# EasyEDA Pro project ProPrj_农9.7_2025-10-01.epro, board PCB3_3
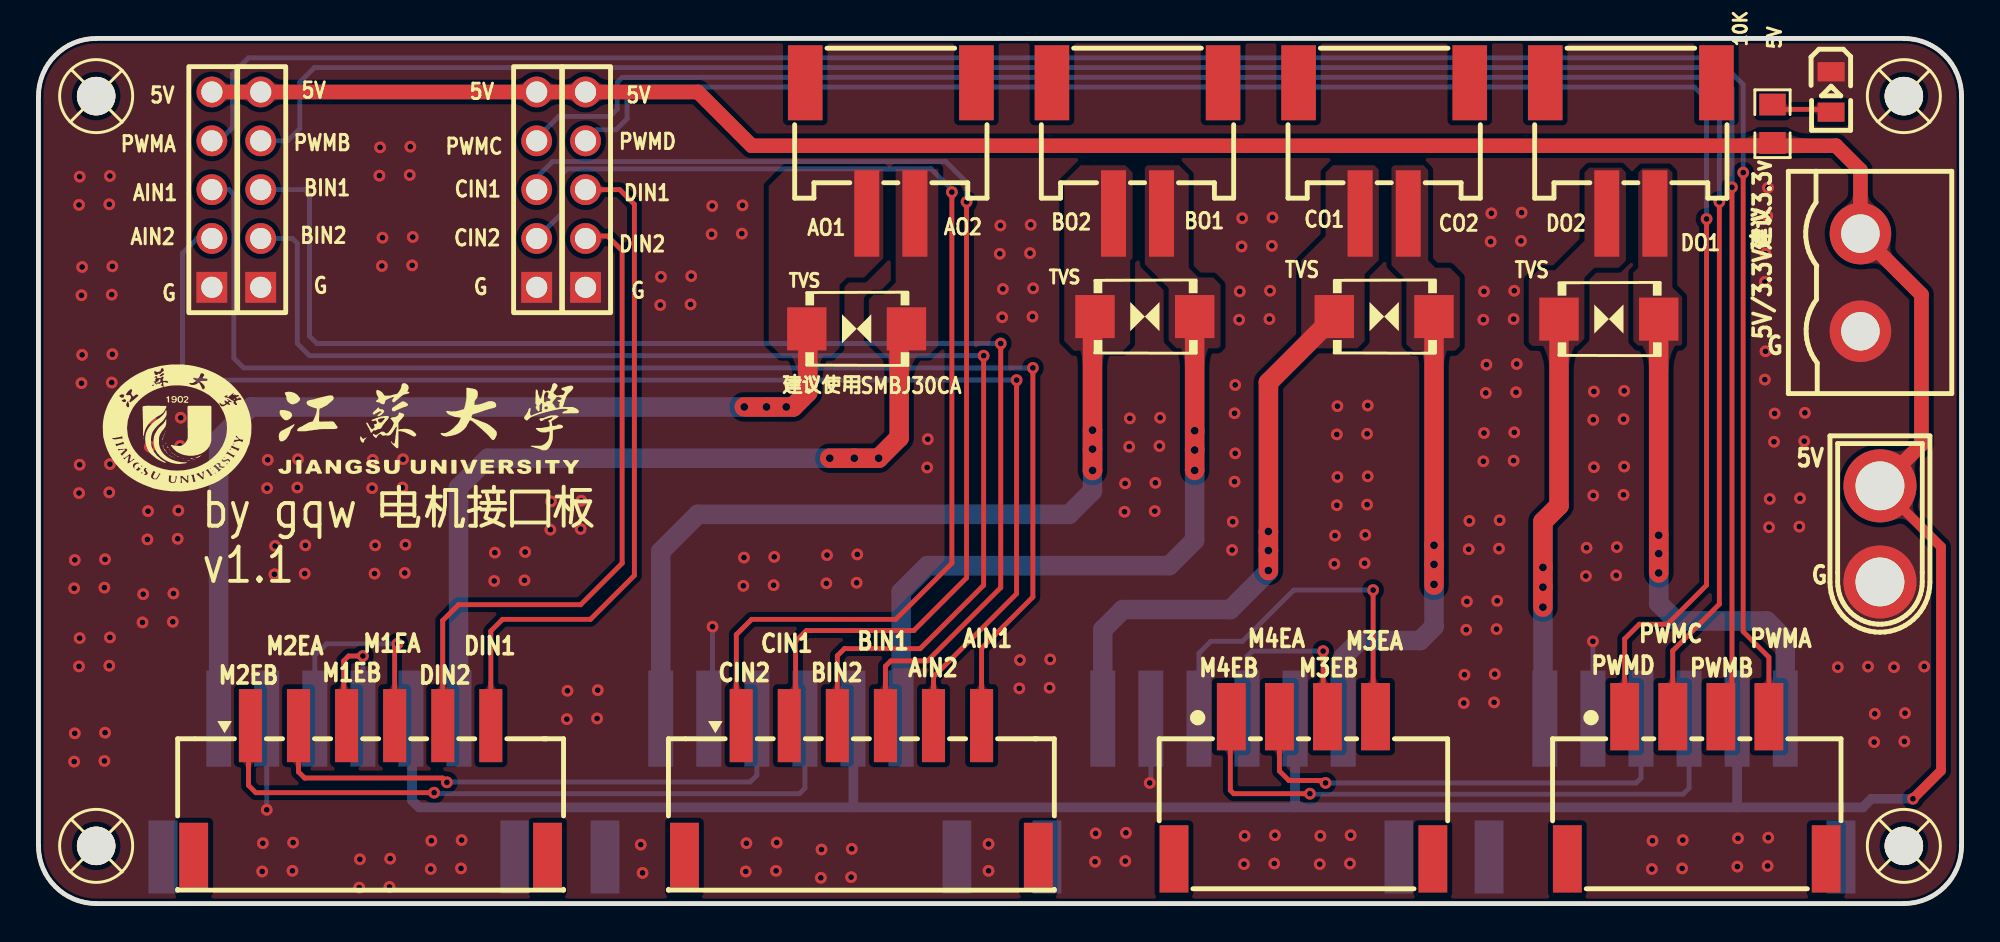
[diagram p8: board, top side]
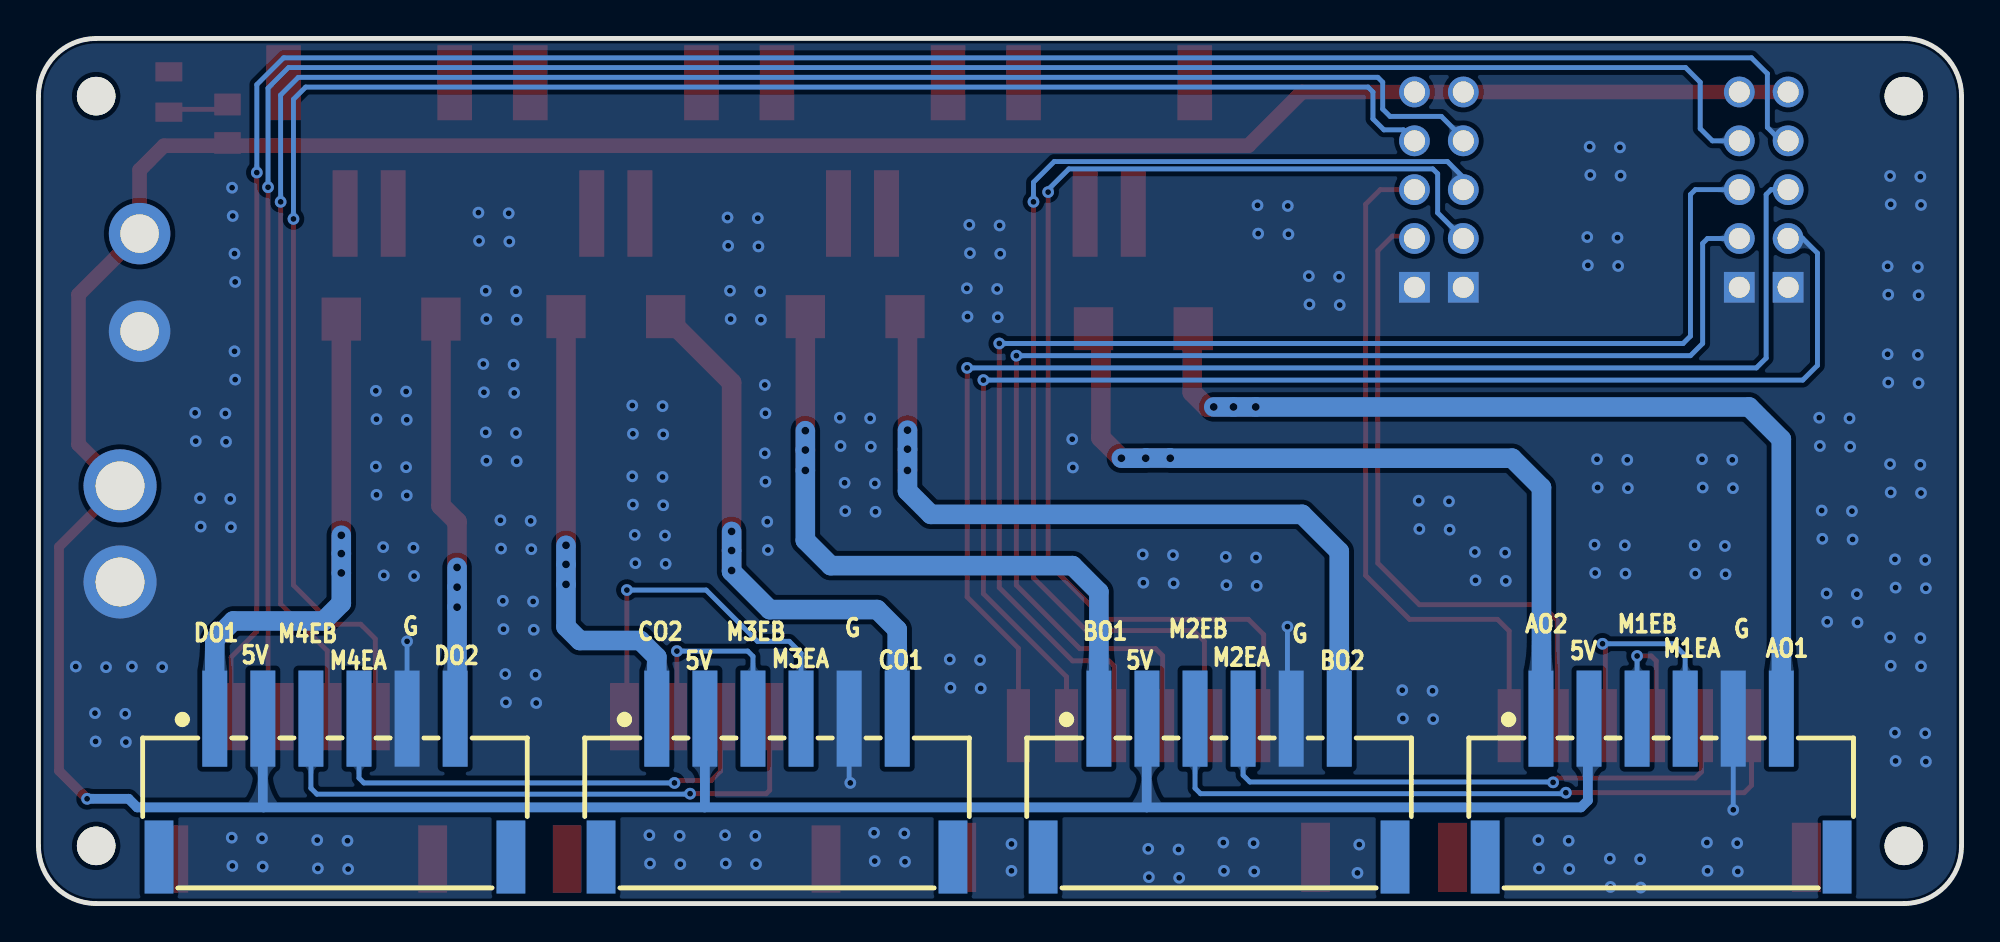
[diagram p9: board, bottom side, seen from below]

Outline 100 x 45 mm; copper layers: Top Layer, Bottom Layer. Coordinates in mm from the lower left corner of the outline.
Outline path: 0,42 0,3 arc(0.88,0.88) 3,0 97,0 arc(99.12,0.88) 100,3 100,42 arc(99.12,44.12) 97,45 3,45 arc(0.88,44.12) 0,42
Stack: Top Layer 0.035mm / Dielectric1 1.51mm FR4 er 4.5 / Bottom Layer 0.035mm

## Design rules (mm)
template: 自定义配置
spacing copperThickness1oz (default): track to track 0.102, other pairs 0.152 to 0.3
spacing copperThickness2oz: track to track 0.203, other pairs 0.152 to 0.3
track width copperThickness1oz (default): min 0.127, default 0.254, max 2.54
track width copperThickness2oz: min 0.203, default 0.254, max 2.54
differential pair differentialPair (default): width min 0.127, default 0.254, max 2.54; gap min 0.152, default 0.152
via viaSize (default): diameter min 0.5, default 0.61, max 10; hole min 0.3, default 0.305, max 6.299

## Placement (name value [footprint] x y rotation side)
5V  NCD0805R1  [LED0805-R-RD]  93.22 42.22 270 top
10K  10K  [R0805]  90.17 40.56 90 top
CN13  HCZZ0021-2  [CONN-SMD_2P-P2.50-A2501-WF-02A]  44.32 39.29 0 top
CN16  WAFER-XH2.54-4PWB  [CONN-TH_4P-P0.20_XUNPU_WAFER-XH2.54-4PWB]  86.23 6.02 0 top
CN49  DB2EVC-5.08-2P-GN  [CONN-TH_2P-P5.08_DB2EVC-5.08-2P]  94.74 32.31 90 top
CN57  XT30U-M  [CONN-TH_XT30U-M]  95.76 19.23 270 top
CN61  WAFER-XH2.54-4PWB  [CONN-TH_4P-P0.20_XUNPU_WAFER-XH2.54-4PWB]  65.78 6.02 0 top
CN62  HCZZ0021-2  [CONN-SMD_2P-P2.50-A2501-WF-02A]  57.15 39.29 0 top
CN63  HCZZ0021-2  [CONN-SMD_2P-P2.50-A2501-WF-02A]  69.98 39.29 0 top
CN64  HCZZ0021-2  [CONN-SMD_2P-P2.50-A2501-WF-02A]  82.8 39.29 0 top
D3  SMBJ30CA  [SMB_L4.6-W3.6-LS5.3-BI]  69.98 30.53 0 top
D4  SMBJ30CA  [SMB_L4.6-W3.6-LS5.3-BI]  81.66 30.4 0 top
SCREW1  -  [M2螺丝]  97 3 0 top
SCREW2  -  [M2螺丝]  3 3 0 top
SCREW3  -  [M2螺丝]  97 42 0 top
SCREW4  -  [M2螺丝]  3 42 0 top
TVS  -  [SMB_L4.6-W3.6-LS5.3-BI]  42.54 29.9 0 top
TVS#2  -  [SMB_L4.6-W3.6-LS5.3-BI]  57.53 30.53 0 top
U6  HX 2.54-6P WT  [CONN-SMD_6P-P2.50_HANXIA_HX-2.54-6P-WT]  84.58 6.02 180 bottom
U11  2.54-6PWT  [COMM-SMD_6P-P2.50_SHOUHAN_2.54-6PWT]  42.79 5.83 0 top
U28  HX 2.54-6P WT  [CONN-SMD_6P-P2.50_HANXIA_HX-2.54-6P-WT]  61.59 6.02 180 bottom
U32  HX 2.54-6P WT  [CONN-SMD_6P-P2.50_HANXIA_HX-2.54-6P-WT]  15.62 6.02 180 bottom
U33  HX 2.54-6P WT  [CONN-SMD_6P-P2.50_HANXIA_HX-2.54-6P-WT]  38.61 6.02 180 bottom
U34  2.54-6PWT  [COMM-SMD_6P-P2.50_SHOUHAN_2.54-6PWT]  17.27 5.83 0 top
U35  双塑单排排针5PIN2.54间距  [HDR-TH_5P-P2.54-V-M-A]  9.02 37.14 90 top
U36  双塑单排排针5PIN2.54间距  [HDR-TH_5P-P2.54-V-M-A]  11.56 37.14 90 top
U37  双塑单排排针5PIN2.54间距  [HDR-TH_5P-P2.54-V-M-A]  25.91 37.14 90 top
U38  双塑单排排针5PIN2.54间距  [HDR-TH_5P-P2.54-V-M-A]  28.45 37.14 90 top

## Footprints (pads in the part's own frame, mm; a bottom-side part is the same pattern mirrored in y, then rotated)
COMM-SMD_6P-P2.50_SHOUHAN_2.54-6PWT
  rect 1.2x3.8 smd: 1(-6.25,3.425) 2(-3.75,3.425) 3(-1.25,3.425) 4(1.25,3.425) 5(3.75,3.425) 6(6.25,3.425)
  rect 1.5x3.6 smd: 7(9.2,-3.425) 8(-9.2,-3.425)
CONN-SMD_2P-P2.50-A2501-WF-02A
  rect 1.3x4.5 smd: 1(-1.25,-3.4) 2(1.25,-3.4)
  rect 1.8x3.9 smd: 3(-4.45,3.4) 4(4.45,3.4)
CONN-SMD_6P-P2.50_HANXIA_HX-2.54-6P-WT
  rect 1.3x5 smd: 1(-6.25,3.6) 2(-3.75,3.6) 3(-1.25,3.6) 4(1.25,3.6) 5(3.75,3.6) 6(6.25,3.6)
  rect 1.5x3.8 smd: 7(-9.15,-3.6) 8(9.15,-3.6)
CONN-TH_2P-P5.08_DB2EVC-5.08-2P
  round 3.2 hole 2: 1(-2.54,0) 2(2.54,0)
CONN-TH_4P-P0.20_XUNPU_WAFER-XH2.54-4PWB
  rect 1.5x3.5 smd: 1(-3.75,3.7) 2(-1.25,3.7) 3(1.25,3.7) 4(3.75,3.7) 5(-6.73,-3.7) 6(6.73,-3.7)
CONN-TH_XT30U-M
  round 3.8 hole 2.54: 1(-2.5,0) 2(2.5,0)
HDR-TH_5P-P2.54-V-M-A
  rect 1.6x1.6 hole 1.1: 1(-5.08,0)
  round 1.6 hole 1.1: 2(-2.54,0) 3(0,0) 4(2.54,0) 5(5.08,0)
LED0805-R-RD
  rect 1x1.399 smd: 1(1.05,0) 2(-1.05,0)
M2螺丝
  round 2 hole 2: 1(0,0)
R0805
  rect 1.133x1.377 smd: 1(-1,0) 2(1,0)
SMB_L4.6-W3.6-LS5.3-BI
  rect 2.047x2.241 smd: 1(-2.591,0) 2(2.591,0)

## Nets
5V: 10K.1 CN49.2 CN57.1 U6.2 U28.2 U32.2 U33.2 U35.5 U36.5 U37.5 U38.5
GND: 5V.2 CN49.1 CN57.2 U6.5 U28.5 U32.5 U33.5 U35.1 U36.1 U37.1 U38.1
AIN1: U11.6 U35.3
AIN2: U11.5 U35.2
AO1: CN13.1 TVS.1 U32.6
AO2: CN13.2 TVS.2 U32.1
BIN1: U11.4 U36.3
BIN2: U11.3 U36.2
BO1: CN62.2 TVS#2.2 U33.1
BO2: CN62.1 TVS#2.1 U33.6
CIN1: U11.2 U37.3
CIN2: U11.1 U37.2
CO1: CN63.1 D3.1 U28.6
CO2: CN63.2 D3.2 U28.1
DIN1: U34.6 U38.3
DIN2: U34.5 U38.2
DO1: CN64.2 D4.2 U6.1
DO2: CN64.1 D4.1 U6.6
M1_ENCODER_A: U32.4 U34.4
M1_ENCODER_B: U32.3 U34.3
M2_ENCODER_A: U33.4 U34.2
M2_ENCODER_B: U33.3 U34.1
M3_ENCODER_A: CN61.4 U28.4
M3_ENCODER_B: CN61.3 U28.3
M4_ENCODER_A: CN61.2 U6.4
M4_ENCODER_B: CN61.1 U6.3
PWMA: CN16.4 U35.4
PWMB: CN16.3 U36.4
PWMC: CN16.2 U37.4
PWMD: CN16.1 U38.4
$1N14387: 5V.1 10K.2

Pads without a net: CN13 3 4; CN16 5 6; CN61 5 6; CN62 3 4; CN63 3 4; CN64 3 4; SCREW1 1; SCREW2 1; SCREW3 1; SCREW4 1; U6 7 8; U11 7 8; U28 7 8; U32 7 8; U33 7 8; U34 7 8

## Via types
v1: diameter 0.61, hole 0.305, Top Layer to Bottom Layer, 269 vias
v2: diameter 0.813, hole 0.406, Top Layer to Bottom Layer, 24 vias

## Routing (per net, layer and track width the routed paths; a pad name or vN(x,y) marks a point on that pad's centre or on a via; arc(x,y) is an arc through that point)
5V: length 220.8
  Top Layer w0.508: v1(97.47,5.45) 98.93,6.91 98.93,18.55 CN57.1
  Top Layer w0.762: CN57.1 97.92,23.89 97.92,31.67 CN49.2 94.74,38.15 93.47,39.42 37.08,39.42 34.29,42.22 U38.5 U37.5 U36.5 U35.5
  Bottom Layer w0.508: U6.2 88.33,5.03 88.3,5 ; 42.37,5 19.79,5 19.43,5.36 19.43,9.56 U32.2 ; 42.37,5 42.37,9.61 U33.2 ; 42.37,5 65.36,5 ; 88.3,5 94.87,5 95.31,5.45 v1(97.47,5.45) ; 88.3,5 65.36,5 ; 65.36,5 65.34,5.02 U28.2
GND: length 17
  Bottom Layer w0.254: U33.5 35.05,9.81 v1(35.05,14.4) ; U28.5 57.84,6.33 v1(57.78,6.27) ; U6.5 v1(80.83,13.64) ; U32.5 v1(11.87,4.88)
  vias: v1(1.89,17.87) v1(1.86,16.4) v1(1.89,8.86) v1(1.86,7.38) v1(2.14,37.81) v1(2.11,36.34) v1(2.14,22.83) v1(2.11,21.35) v1(2.14,13.81) v1(2.11,12.34) v1(2.24,31.64) v1(2.24,27.07) v1(2.27,33.11) v1(2.27,28.54) v1(3.43,16.43) v1(3.43,7.42) v1(3.46,17.91) v1(3.46,8.89) v1(3.72,37.84) v1(3.68,36.37) v1(3.72,22.86) v1(3.68,21.39) v1(3.72,13.84) v1(3.68,12.37) v1(3.84,33.15) v1(3.81,31.67) v1(3.84,28.57) v1(3.81,27.1) v1(5.44,16.09) v1(5.41,14.62) v1(5.7,20.41) v1(5.67,18.94) v1(5.83,25.24) v1(5.79,23.77) v1(7.02,16.13) v1(6.98,14.66) v1(7.24,18.97) v1(7.27,20.45) v1(7.4,25.27) v1(7.37,23.8) v1(11.63,1.67) v1(11.67,3.14) v1(11.92,23.08) v1(11.89,21.61) v1(12.3,18.6) v1(12.27,17.13) v1(13.24,3.17) v1(13.21,1.7) v1(13.5,23.11) v1(13.46,21.64) v1(13.84,17.16) v1(13.88,18.63) v1(16.71,2.3) v1(16.68,0.83) v1(17.35,21.61) v1(17.38,23.08) v1(17.51,18.63) v1(17.48,17.16) v1(17.73,37.86) v1(17.76,39.33) v1(17.89,34.64) v1(17.86,33.16) v1(18.29,2.34) v1(18.25,0.87) v1(18.92,21.64) v1(18.96,23.11) v1(19.05,17.2) v1(19.08,18.67) v1(19.34,39.37) v1(19.3,37.9) v1(19.43,33.2) v1(19.46,34.67) v1(20.43,3.27) v1(20.4,1.8) v1(22,3.3) v1(21.97,1.83) v1(23.73,18.25) v1(23.7,16.78) v1(25.31,18.29) v1(25.27,16.81) v1(26.62,19.45) v1(26.65,20.92) v1(27.51,11.07) v1(27.48,9.59) v1(28.23,20.95) v1(28.19,19.48) v1(29.05,9.63) v1(29.08,11.1) v1(31.32,3.07) v1(31.41,1.59) v1(32.34,31.13) v1(32.37,32.6) v1(33.94,32.64) v1(33.91,31.17) v1(35.04,36.29) v1(35,34.82) v1(36.61,36.32) v1(36.58,34.85) v1(36.69,18) v1(36.65,16.53) v1(36.81,3.14) v1(36.78,1.67) v1(38.23,16.56) v1(38.26,18.03) v1(38.39,3.17) v1(38.35,1.7) v1(40.72,2.81) v1(40.68,1.34) v1(41,18.13) v1(40.97,16.65) v1(42.29,2.84) v1(42.26,1.37) v1(42.54,16.69) v1(42.58,18.16) v1(46.24,24.16) v1(46.21,22.68) v1(49.4,3.1) v1(49.4,1.7) v1(50.02,35.27) v1(49.99,33.8) v1(50.15,31.97) v1(50.12,30.5) v1(51.04,12.67) v1(51,11.19) v1(51.6,35.31) v1(51.56,33.83) v1(51.72,32) v1(51.69,30.53) v1(52.61,12.7) v1(52.58,11.23) v1(54.94,2.18) v1(54.97,3.65) v1(56.51,21.85) v1(56.47,20.38) v1(56.55,3.68) v1(56.51,2.21) v1(56.72,23.77) v1(56.75,25.24) v1(58.05,20.41) v1(58.08,21.89) v1(58.33,25.27) v1(58.29,23.8) v1(62.1,19.86) v1(62.07,18.39) v1(62.23,26.97) v1(62.2,25.5) v1(62.23,23.42) v1(62.2,21.95) v1(62.43,30.37) v1(62.47,31.84) v1(62.59,35.65) v1(62.56,34.18) v1(62.72,3.52) v1(62.69,2.05) v1(64.04,31.88) v1(64.01,30.4) v1(64.13,34.21) v1(64.17,35.69) v1(64.3,3.56) v1(64.26,2.08) v1(66.62,2.05) v1(66.66,3.52) v1(67.42,19.14) v1(67.39,17.67) v1(67.55,25.87) v1(67.51,24.4) v1(67.55,22.19) v1(67.51,20.72) v1(68.23,3.56) v1(68.2,2.08) v1(68.99,19.18) v1(68.96,17.7) v1(69.12,25.91) v1(69.09,24.44) v1(69.12,22.22) v1(69.09,20.75) v1(74.12,10.43) v1(74.25,14.24) v1(74.15,11.9) v1(74.28,15.71) v1(74.41,19.9) v1(74.37,18.43) v1(75.13,30.37) v1(75.13,23) v1(75.17,31.84) v1(75.17,24.48) v1(75.29,28.03) v1(75.26,26.56) v1(75.55,35.91) v1(75.51,34.43) v1(75.73,11.94) v1(75.69,10.47) v1(75.82,14.28) v1(75.95,18.47) v1(75.85,15.75) v1(75.98,19.94) v1(76.74,31.88) v1(76.71,30.4) v1(76.74,24.51) v1(76.71,23.04) v1(76.84,26.59) v1(76.87,28.07) v1(77.12,35.94) v1(77.09,34.47) v1(80.5,18.51) v1(80.47,17.04) v1(80.85,25.16) v1(80.85,21.23) v1(80.88,26.64) v1(80.88,22.7) v1(82.04,17.07) v1(82.08,18.54) v1(82.42,25.2) v1(82.42,21.26) v1(82.46,26.67) v1(82.46,22.73) v1(83.93,3.27) v1(83.9,1.8) v1(85.5,3.3) v1(85.47,1.83) v1(88.34,1.92) v1(88.38,3.39) v1(89.81,33.81) v1(89.77,32.33) v1(89.81,28.73) v1(89.77,27.25) v1(89.93,37.24) v1(89.9,35.76) v1(89.95,3.43) v1(89.92,1.96) v1(90.03,21.05) v1(89.99,19.58) v1(90.25,24.02) v1(90.28,25.49) v1(91.6,21.08) v1(91.57,19.61) v1(91.82,24.05) v1(91.85,25.53) v1(93.57,12.3) v1(95.14,12.33) v1(95.49,9.87) v1(95.45,8.4) v1(96.49,12.3) v1(97.03,8.43) v1(97.06,9.91) v1(98.06,12.33)
AIN1: length 71.2
  Top Layer w0.254: U11.6 49.04,13.28 51.71,15.95 v1(51.71,27.86)
  Bottom Layer w0.254: U35.3 9.91,37.14 10.16,36.88 10.16,28.37 10.67,27.86 v1(51.71,27.86)
AIN2: length 71.1
  Top Layer w0.254: v1(50.86,27.23) 50.86,16.12 46.54,11.8 U11.5
  Bottom Layer w0.254: v1(50.86,27.23) 8.25,27.23 7.49,27.99 7.49,33.83 8.25,34.59 U35.2
AO1: length 51.7
  Top Layer w1.016: TVS.1 40,29.84 40,26.59 39.24,25.83 v2(37.86,25.83) v2(36.7,25.83)
  Bottom Layer w1.016: v2(38.89,25.83) v2(37.86,25.83) v2(36.7,25.83) 11.05,25.83 9.37,24.15 U32.6
AO2: length 44.4
  Top Layer w1.016: v2(41.15,23.17) v2(42.42,23.17) v2(43.69,23.17) 44.76,24.23 44.76,29.52 TVS.2
  Bottom Layer w1.016: U32.1 21.84,9.65 21.84,21.64 23.37,23.17 v2(41.15,23.17) 41.16,23.17 42.41,23.17 v2(42.42,23.17) v2(43.69,23.17)
BIN1: length 69.6
  Top Layer w0.254: v1(50.04,29.13) 50.04,16.43 46.23,12.62 44.32,12.62 44.04,12.34 U11.4
  Bottom Layer w0.254: U36.3 13.84,37.14 14.1,36.88 14.1,29.52 14.48,29.13 v1(50.04,29.13)
BIN2: length 67.9
  Top Layer w0.254: U11.3 41.54,12.89 41.91,13.26 45.85,13.26 49.15,16.56 v1(49.15,28.5)
  Bottom Layer w0.254: v1(49.15,28.5) 14.1,28.5 13.46,29.13 13.46,34.34 13.21,34.59 U36.2
BO1: length 36.7
  Top Layer w1.016: TVS#2.2 v2(60.12,24.6) v2(60.12,23.59) v2(60.12,22.53)
  Bottom Layer w1.016: v2(60.12,24.6) v2(60.12,23.59) v2(60.12,22.53) 60.12,18.9 58.8,17.58 46.23,17.58 44.86,16.21 U33.1
BO2: length 43.7
  Top Layer w1.016: v2(54.81,22.53) 54.81,22.53 v2(54.81,23.64) v2(54.81,24.62) 54.81,30.4 TVS#2.1
  Bottom Layer w1.016: U33.6 32.36,18.31 34.29,20.24 53.59,20.24 54.81,21.46 v2(54.81,23.64) v2(54.81,24.62)
CIN1: length 59.2
  Top Layer w0.254: v1(48.26,36.5) 48.26,16.94 45.52,14.2 39.93,14.2 39.37,13.64 39.37,9.58 U11.2
  Bottom Layer w0.254: v1(48.26,36.5) 48.26,37.52 47.18,38.6 26.73,38.6 25.78,37.64 25.78,37.14
CIN2: length 61.7
  Top Layer w0.254: U11.1 36.29,9.51 36.29,13.99 37.08,14.78 44.58,14.78 47.5,17.7 v1(47.5,37.01)
  Bottom Layer w0.254: U37.2 27.24,35.93 27.24,37.96 27.5,38.21 46.42,38.21 47.5,37.14 v1(47.5,37.01)
CO1: length 31.2
  Top Layer w1.016: v2(63.96,17.32) v2(63.96,18.36) v2(63.96,19.36) 63.96,27.1 D3.1
  Bottom Layer w1.016: v2(63.96,19.36) v2(63.96,18.36) v2(63.96,17.32) 63.96,17.27 61.98,15.29 56.39,15.29 55.34,14.25 U28.6
CO2: length 26.8
  Top Layer w1.016: 72.57,16.56 v2(72.57,17.64) v2(72.57,18.64) D3.2
  Bottom Layer w1.016: v2(72.57,18.64) v2(72.57,17.64) v2(72.57,16.6) 72.57,14.4 71.85,13.68 68.71,13.68 67.84,12.82 U28.1
DIN1: length 35.7
  Top Layer w0.254: U34.6 23.52,14.17 24.13,14.78 28.7,14.78 30.99,17.07 30.99,36.37 30.23,37.14 U38.3
DIN2: length 34.6
  Top Layer w0.254: U38.2 28.57,34.72 29.59,34.72 30.35,33.96 30.35,17.7 28.19,15.55 21.84,15.55 21.02,14.72 U34.5
DO1: length 28.2
  Top Layer w1.016: v2(84.25,17.2) v2(84.25,18.2) v2(84.25,19.16) D4.2
  Bottom Layer w1.016: v2(84.25,19.16) v2(84.25,18.2) v2(84.25,17.2) 84.25,15.62 85.17,14.7 89.87,14.7 90.83,13.74 U6.1
DO2: length 23.2
  Top Layer w1.016: D4.1 79.07,20.7 78.23,19.86 v2(78.23,17.48) v2(78.23,16.46) v2(78.23,15.42)
  Bottom Layer w1.016: U6.6 78.23,9.72 v2(78.23,15.42) v2(78.23,16.46) v2(78.23,17.48)
M1_ENCODER_A: length 12.2
  Top Layer w0.254: U34.4 18.52,13.37 v1(18.67,13.51)
  Bottom Layer w0.254: v1(18.67,13.51) 14.99,13.51 14.37,12.9 U32.4
M1_ENCODER_B: length 7.8
  Top Layer w0.254: v1(16.87,12.88) 16.13,12.88 15.88,12.62 15.88,9.4 U34.3
  Bottom Layer w0.254: U32.3 v1(16.87,12.88)
M2_ENCODER_A: length 29.6
  Top Layer w0.254: U34.2 13.52,6.85 13.84,6.53 21.02,6.53 v1(21.24,6.31)
  Bottom Layer w0.254: v1(21.24,6.31) 21.26,6.32 37.01,6.32 37.36,6.67 U33.4
M2_ENCODER_B: length 36
  Top Layer w0.254: U34.1 10.92,9.15 10.92,6.15 11.3,5.77 v1(20.57,5.77)
  Bottom Layer w0.254: v1(20.57,5.77) 20.7,5.77 20.75,5.71 39.57,5.71 39.86,6 U33.3
M3_ENCODER_A: length 20.5
  Top Layer w0.254: CN61.4 69.4,9.85 v1(69.4,16.31)
  Bottom Layer w0.254: U28.4 60.34,13.03 60.96,13.64 62.61,13.64 65.28,16.31 v1(69.4,16.31)
M3_ENCODER_B: length 10.8
  Top Layer w0.254: v1(66.8,13.13) 66.8,9.95 CN61.3
  Bottom Layer w0.254: U28.3 62.84,12.86 63.12,13.13 v1(66.8,13.13)
M4_ENCODER_A: length 25.1
  Top Layer w0.254: CN61.2 64.53,6.9 65.02,6.4 66.8,6.4 v1(66.93,6.27)
  Bottom Layer w0.254: v1(66.93,6.27) 83.08,6.27 83.33,6.53 U6.4
M4_ENCODER_B: length 31.6
  Top Layer w0.254: CN61.1 61.98,9.67 61.98,5.89 62.15,5.72 v1(66.12,5.72)
  Bottom Layer w0.254: 66.04,5.64 66.09,5.69 85.52,5.69 85.83,6 U6.3
PWMA: length 117.1
  Top Layer w0.254: CN16.4 89.98,12.81 88.65,14.15 v1(88.65,38.02)
  Bottom Layer w0.254: U35.4 9.4,39.67 10.1,40.37 10.1,43.17 10.92,43.99 87.25,43.99 88.65,42.6 v1(88.65,38.02)
PWMB: length 112.9
  Top Layer w0.254: CN16.3 88.06,10.3 v1(88.06,37.26)
  Bottom Layer w0.254: v1(88.06,37.26) 88.06,42.42 87,43.48 14.35,43.48 13.59,42.72 13.59,40.31 12.95,39.67 U36.4
PWMC: length 97.5
  Top Layer w0.254: v1(87.41,36.5) 87.41,15.58 84.98,13.15 CN16.2
  Bottom Layer w0.254: v1(87.41,36.5) 87.41,42.06 86.49,42.98 30.35,42.98 30.1,42.72 30.1,41.33 29.72,40.94 27.05,40.94 25.91,39.8 U37.4
PWMD: length 95.3
  Top Layer w0.254: CN16.1 82.48,13.77 83.25,14.53 84.71,14.53 86.74,16.56 v1(86.74,35.61)
  Bottom Layer w0.254: v1(86.74,35.61) 86.74,41.83 86.11,42.47 30.86,42.47 30.61,42.22 30.61,40.82 30.04,40.25 29.02,40.25 U38.4
$1N14387: length 3.2
  Top Layer w0.254: 10K.2 90.42,41.31 93.07,41.31 5V.1

## Copper pours and planes (outline as drawn; the poured copper is in the pictures)
GND on Top Layer: -11.18,53.26 115.06,53.26 115.06,-16.84 -11.18,-16.84
GND on Bottom Layer: -25.91,58.98 128.52,58.98 128.52,-25.73 -25.91,-25.73
AO1 on Top Layer: 37.97,38.21 43.93,38.21 43.93,28.5 37.97,28.5
AO2 on Top Layer: 43.18,38.21 46.79,38.21 46.79,28.5 43.18,28.5
BO1 on Top Layer: 57.53,38.41 61.47,38.41 61.47,28.88 57.53,28.88
BO2 on Top Layer: 53.34,38.41 56.9,38.41 56.9,28.75 53.34,28.75
CO1 on Top Layer: 65.66,38.41 69.7,38.41 69.7,28.88 65.66,28.88
CO2 on Top Layer: 70.36,38.41 73.91,38.41 73.91,28.75 70.36,28.75
DO1 on Top Layer: 82.93,38.24 85.47,38.24 85.47,29.02 82.93,29.02
DO2 on Top Layer: 77.49,38.28 82.55,38.28 82.55,29.01 77.49,29.01

Small or netless copper shapes (teardrops, artwork), in the pictures only: 65 on Top Layer, 59 on Bottom Layer

## Text on the board
Bottom Silkscreen Layer: AO1 | G | M1EA | M1EB | 5V | AO2 | BO2 | M2EA | M2EB | BO1 | CO1 | M3EA | M3EB | CO2 | DO2 | M4EA | M4EB | DO1
Top Silkscreen Layer: PWMA | AIN2 | AIN1 | 5V | G | PWMB | BIN2 | BIN1 | PWMC | CIN2 | CIN1 | PWMD | DIN2 | DIN1 | AO1 | AO2 | BO2 | BO1 | TVS | CO1 | CO2 | DO2 | DO1 | M2EB | M2EA | M1EB | M1EA | M4EB | M4EA | M3EB | M3EA | 建议使用SMBJ30CA | 5V/3.3V建议3.3v | by gqw 电机接口板 / v1.1
